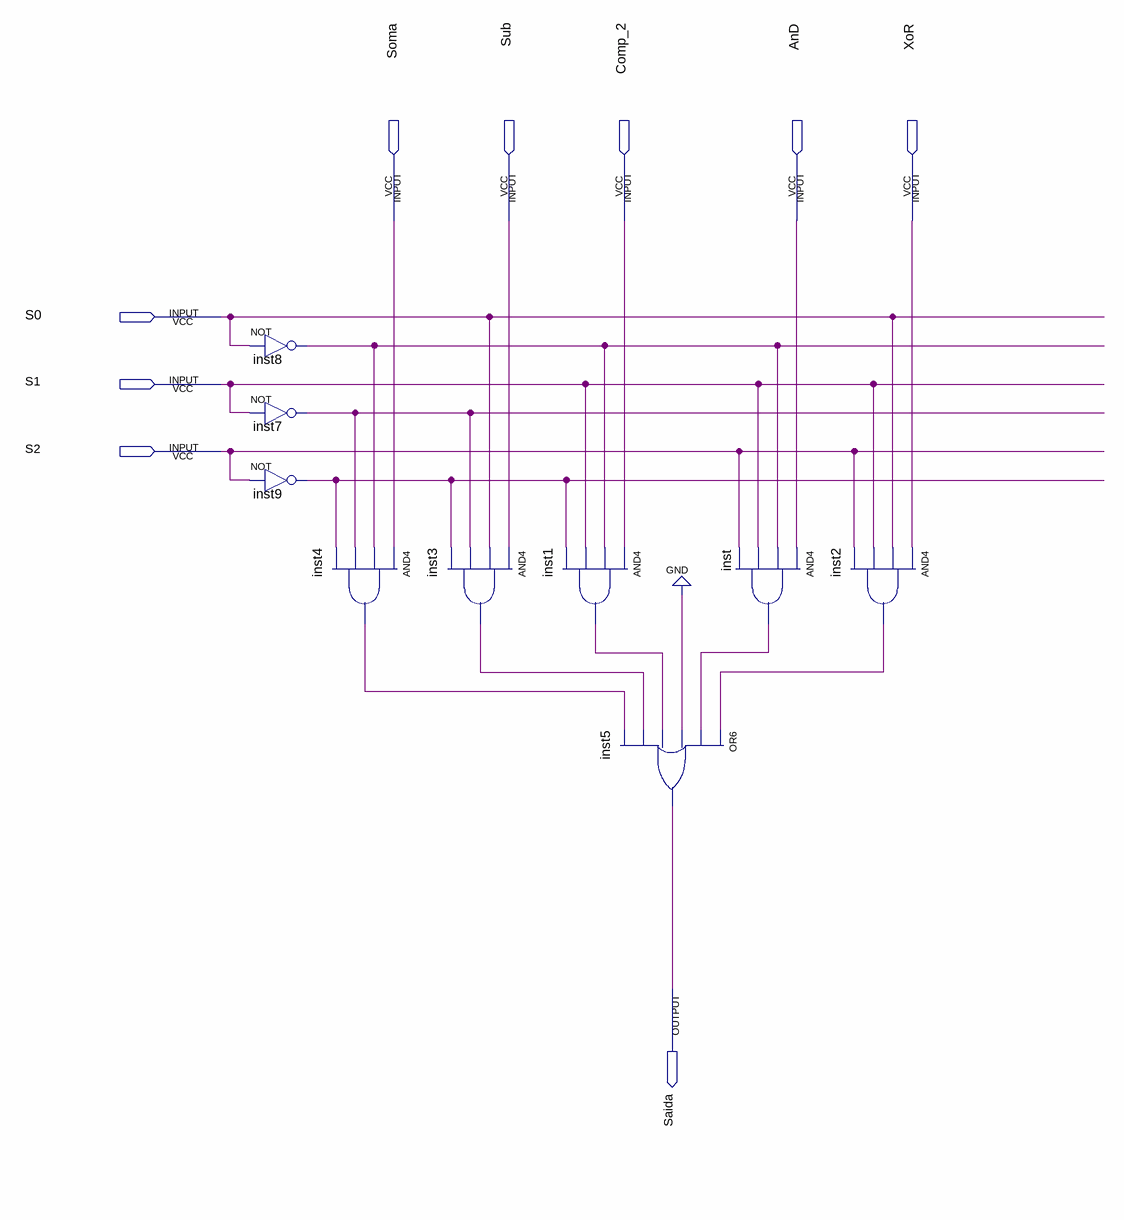
[diagram p0: schematic sheet]
// Quartus schematic MUX_8_para_1_bit.bdf as structural Verilog: 9 symbols, 9 pins
module MUX_8_para_1_bit (
  input  Soma,
  input  Sub,
  input  Comp_2,
  input  AnD,
  input  XoR,
  input  S0,
  input  S1,
  input  S2,
  output Saida
);

  wire inst1_out, inst2_out, inst3_out, inst4_out, inst7_out, inst8_out, inst9_out, inst_out;

  not inst8 (inst8_out, S0);
  not inst7 (inst7_out, S1);
  not inst9 (inst9_out, S2);
  and inst4 (inst4_out, Soma, inst8_out, inst7_out, inst9_out);
  and inst3 (inst3_out, Sub, S0, inst7_out, inst9_out);
  and inst1 (inst1_out, Comp_2, inst8_out, S1, inst9_out);
  or inst5 (Saida, inst2_out, inst_out, 1'b0, inst1_out, inst3_out, inst4_out);
  and inst (inst_out, AnD, inst8_out, S1, S2);
  and inst2 (inst2_out, XoR, S0, S1, S2);
endmodule
